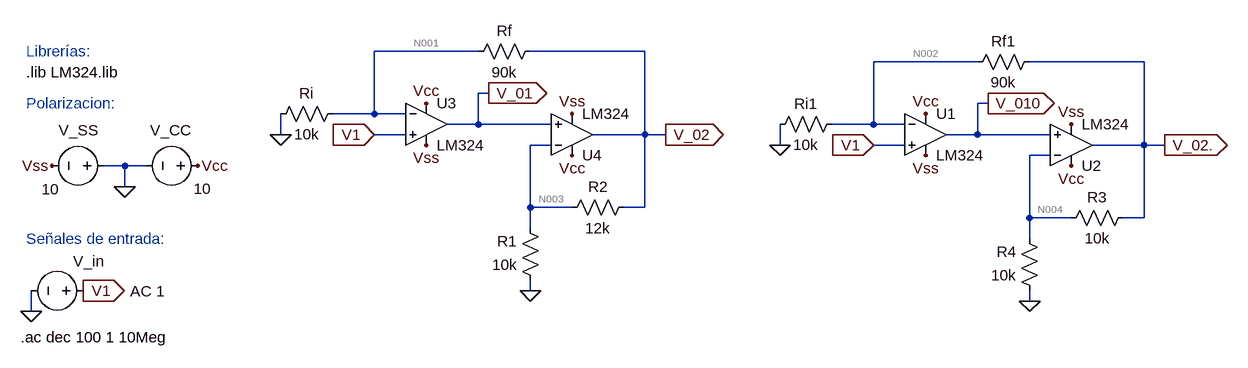
[diagram p0: schematic Lab_3_Circ_1-5.asc]
Lab_3_Circ_1-5.asc, the LTspice schematic file:
Version 4
SHEET 1 1764 680
WIRE 576 -432 416 -432
WIRE 832 -432 656 -432
WIRE 1344 -416 1184 -416
WIRE 1600 -416 1424 -416
WIRE 592 -368 576 -368
WIRE 1360 -352 1344 -352
WIRE 416 -336 416 -432
WIRE 416 -336 352 -336
WIRE 464 -336 416 -336
WIRE 576 -320 576 -368
WIRE 576 -320 528 -320
WIRE 688 -320 576 -320
WIRE 1184 -320 1184 -416
WIRE 1184 -320 1120 -320
WIRE 1232 -320 1184 -320
WIRE 272 -304 272 -336
WIRE 464 -304 416 -304
WIRE 832 -304 832 -432
WIRE 832 -304 752 -304
WIRE 864 -304 832 -304
WIRE 1344 -304 1344 -352
WIRE 1344 -304 1296 -304
WIRE 1456 -304 1344 -304
WIRE 688 -288 656 -288
WIRE 1040 -288 1040 -320
WIRE 1232 -288 1184 -288
WIRE 1600 -288 1600 -416
WIRE 1600 -288 1520 -288
WIRE 1632 -288 1600 -288
WIRE 1456 -272 1424 -272
WIRE 32 -256 0 -256
WIRE 64 -256 32 -256
WIRE 32 -224 32 -256
WIRE 656 -192 656 -288
WIRE 720 -192 656 -192
WIRE 832 -192 832 -304
WIRE 832 -192 800 -192
WIRE 1424 -176 1424 -272
WIRE 1488 -176 1424 -176
WIRE 1600 -176 1600 -288
WIRE 1600 -176 1568 -176
WIRE 656 -160 656 -192
WIRE 1424 -144 1424 -176
WIRE 656 -64 656 -80
WIRE 1424 -48 1424 -64
WIRE -112 -32 -112 -64
FLAG 144 -256 Vcc
FLAG -80 -256 Vss
FLAG 32 -224 0
FLAG -112 -32 0
FLAG -32 -64 V1
IOPIN -32 -64 Out
FLAG 496 -352 Vcc
FLAG 496 -288 Vss
FLAG 416 -304 V1
IOPIN 416 -304 In
FLAG 864 -304 V_02
IOPIN 864 -304 Out
FLAG 720 -272 Vcc
FLAG 720 -336 Vss
FLAG 272 -304 0
FLAG 592 -368 V_01
IOPIN 592 -368 Out
FLAG 656 -64 0
FLAG 1264 -336 Vcc
FLAG 1264 -272 Vss
FLAG 1184 -288 V1
IOPIN 1184 -288 In
FLAG 1632 -288 V_02.
IOPIN 1632 -288 Out
FLAG 1488 -256 Vcc
FLAG 1488 -320 Vss
FLAG 1040 -288 0
FLAG 1360 -352 V_010
IOPIN 1360 -352 Out
FLAG 1424 -48 0
SYMBOL voltage -16 -64 M270
WINDOW 0 45 31 VLeft 2
WINDOW 3 1 -53 VLeft 2
WINDOW 123 -1 -56 VLeft 2
WINDOW 39 0 0 Left 0
SYMATTR InstName V_in
SYMATTR Value ""
SYMATTR Value2 AC 1
SYMBOL voltage 160 -256 R90
WINDOW 0 -55 25 VRight 2
WINDOW 3 35 -5 VRight 2
WINDOW 123 0 0 Left 0
WINDOW 39 0 0 Left 0
SYMATTR InstName V_CC
SYMATTR Value 10
SYMBOL voltage 16 -256 R90
WINDOW 0 -55 25 VRight 2
WINDOW 3 36 85 VRight 2
WINDOW 123 0 0 Left 0
WINDOW 39 0 0 Left 0
SYMATTR InstName V_SS
SYMATTR Value 10
SYMBOL OpAmps\\opamp2 496 -384 R0
SYMATTR InstName U3
SYMATTR Value LM324
SYMBOL OpAmps\\opamp2 720 -240 M180
SYMATTR InstName U4
SYMATTR Value LM324
SYMBOL res 672 -448 R90
WINDOW 0 0 56 VBottom 2
WINDOW 3 32 56 VTop 2
SYMATTR InstName Rf
SYMATTR Value 90k
SYMBOL res 368 -352 R90
WINDOW 0 0 56 VBottom 2
WINDOW 3 32 56 VTop 2
SYMATTR InstName Ri
SYMATTR Value 10k
SYMBOL res 816 -208 R90
WINDOW 0 0 56 VBottom 2
WINDOW 3 32 56 VTop 2
SYMATTR InstName R2
SYMATTR Value 12k
SYMBOL res 672 -64 R180
WINDOW 0 36 76 Left 2
WINDOW 3 36 40 Left 2
SYMATTR InstName R1
SYMATTR Value 10k
SYMBOL OpAmps\\opamp2 1264 -368 R0
SYMATTR InstName U1
SYMATTR Value LM324
SYMBOL OpAmps\\opamp2 1488 -224 M180
SYMATTR InstName U2
SYMATTR Value LM324
SYMBOL res 1440 -432 R90
WINDOW 0 0 56 VBottom 2
WINDOW 3 32 56 VTop 2
SYMATTR InstName Rf1
SYMATTR Value 90k
SYMBOL res 1136 -336 R90
WINDOW 0 0 56 VBottom 2
WINDOW 3 32 56 VTop 2
SYMATTR InstName Ri1
SYMATTR Value 10k
SYMBOL res 1584 -192 R90
WINDOW 0 0 56 VBottom 2
WINDOW 3 32 56 VTop 2
SYMATTR InstName R3
SYMATTR Value 10k
SYMBOL res 1440 -48 R180
WINDOW 0 36 76 Left 2
WINDOW 3 36 40 Left 2
SYMATTR InstName R4
SYMATTR Value 10k
TEXT -120 -400 Left 2 !.lib LM324.lib
TEXT -120 -432 Left 2 ;Librerías:
TEXT -120 -352 Left 2 ;Polarizacion:
TEXT -120 -144 Left 2 ;Señales de entrada:
TEXT -128 8 Left 2 !.ac dec 100 1 10Meg

The netlist it stands for:
* Lab_3_Circ_1-5.asc
V_in V1 0 AC 1
V_CC Vcc 0 10
V_SS 0 Vss 10
XU3 V1 N001 Vcc Vss V_01 LM324  ; pins In+ In- V+ V- OUT
XU4 V_01 N003 Vcc Vss V_02 LM324  ; pins In+ In- V+ V- OUT
Rf V_02 N001 90k
Ri N001 0 10k
R2 V_02 N003 12k
R1 0 N003 10k
XU1 V1 N002 Vcc Vss V_010 LM324  ; pins In+ In- V+ V- OUT
XU2 V_010 N004 Vcc Vss V_02. LM324  ; pins In+ In- V+ V- OUT
Rf1 V_02. N002 90k
Ri1 N002 0 10k
R3 V_02. N004 10k
R4 0 N004 10k
.lib LM324.lib
* Librerías:
* Polarizacion:
* Señales de entrada:
.ac dec 100 1 10Meg
.backanno
.end

* Results of the author's LTspice run, read from the files saved beside the schematic
* Operating Point, zero values left out:
*   V(vcc) = 10 V
*   V(vss) = -10 V
*   V(v_01) = -826.3 µV
*   V(n001) = -33.65 µV
*   V(v_02) = -2.131 mV
*   V(n003) = -859.9 µV
*   V(v_010) = -932.2 µV
*   V(n002) = -33.65 µV
*   V(v_02.) = -2.131 mV
*   V(n004) = -965.8 µV
*   I(R4) = 96.58 nA
*   I(R3) = -116.5 nA
*   I(Ri1) = -3.365 nA
*   I(Rf1) = -23.3 nA
*   I(R1) = 85.99 nA
*   I(R2) = -105.9 nA
*   I(Ri) = -3.365 nA
*   I(Rf) = -23.3 nA
*   I(V_ss) = -2.679 mA
*   I(V_cc) = -2.68 mA
*   I(V_in) = 39.84 nA
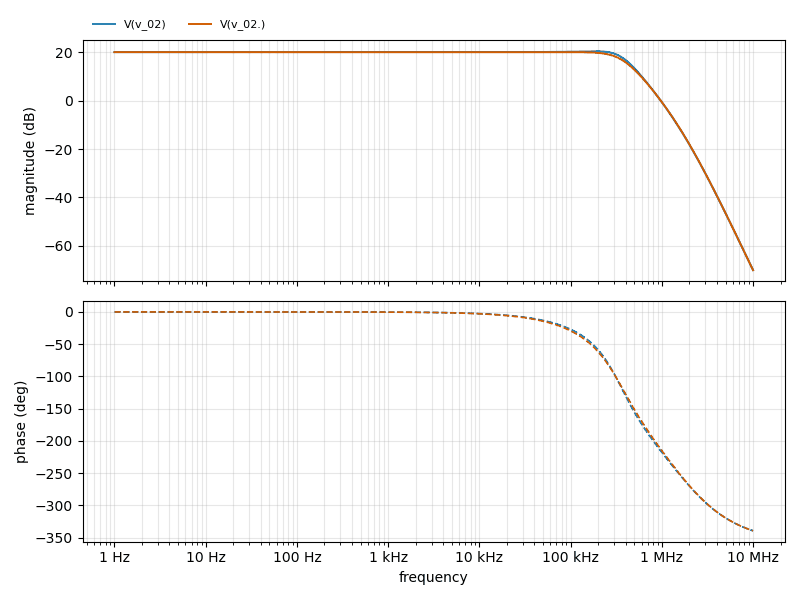
[diagram p1: AC Analysis of Lab_3_Circ_1-5.asc, plotted from the saved traces]
* AC Analysis, 1 run:
*   V(v_02): 20.00 dB at 1 Hz, -70.02 dB at 10 MHz, peak 20.34 dB at 182 kHz, 3 dB below the peak at 381.4 kHz
*   V(v_02.): 20.00 dB at 1 Hz, -70.01 dB at 10 MHz, peak 20.00 dB at 69.18 kHz, 3 dB below the peak at 357.1 kHz